# EAGLE schematic PKG900000001531 (EAGLE 7.7.0), part 2 of 2
## Sheet 25 of 32
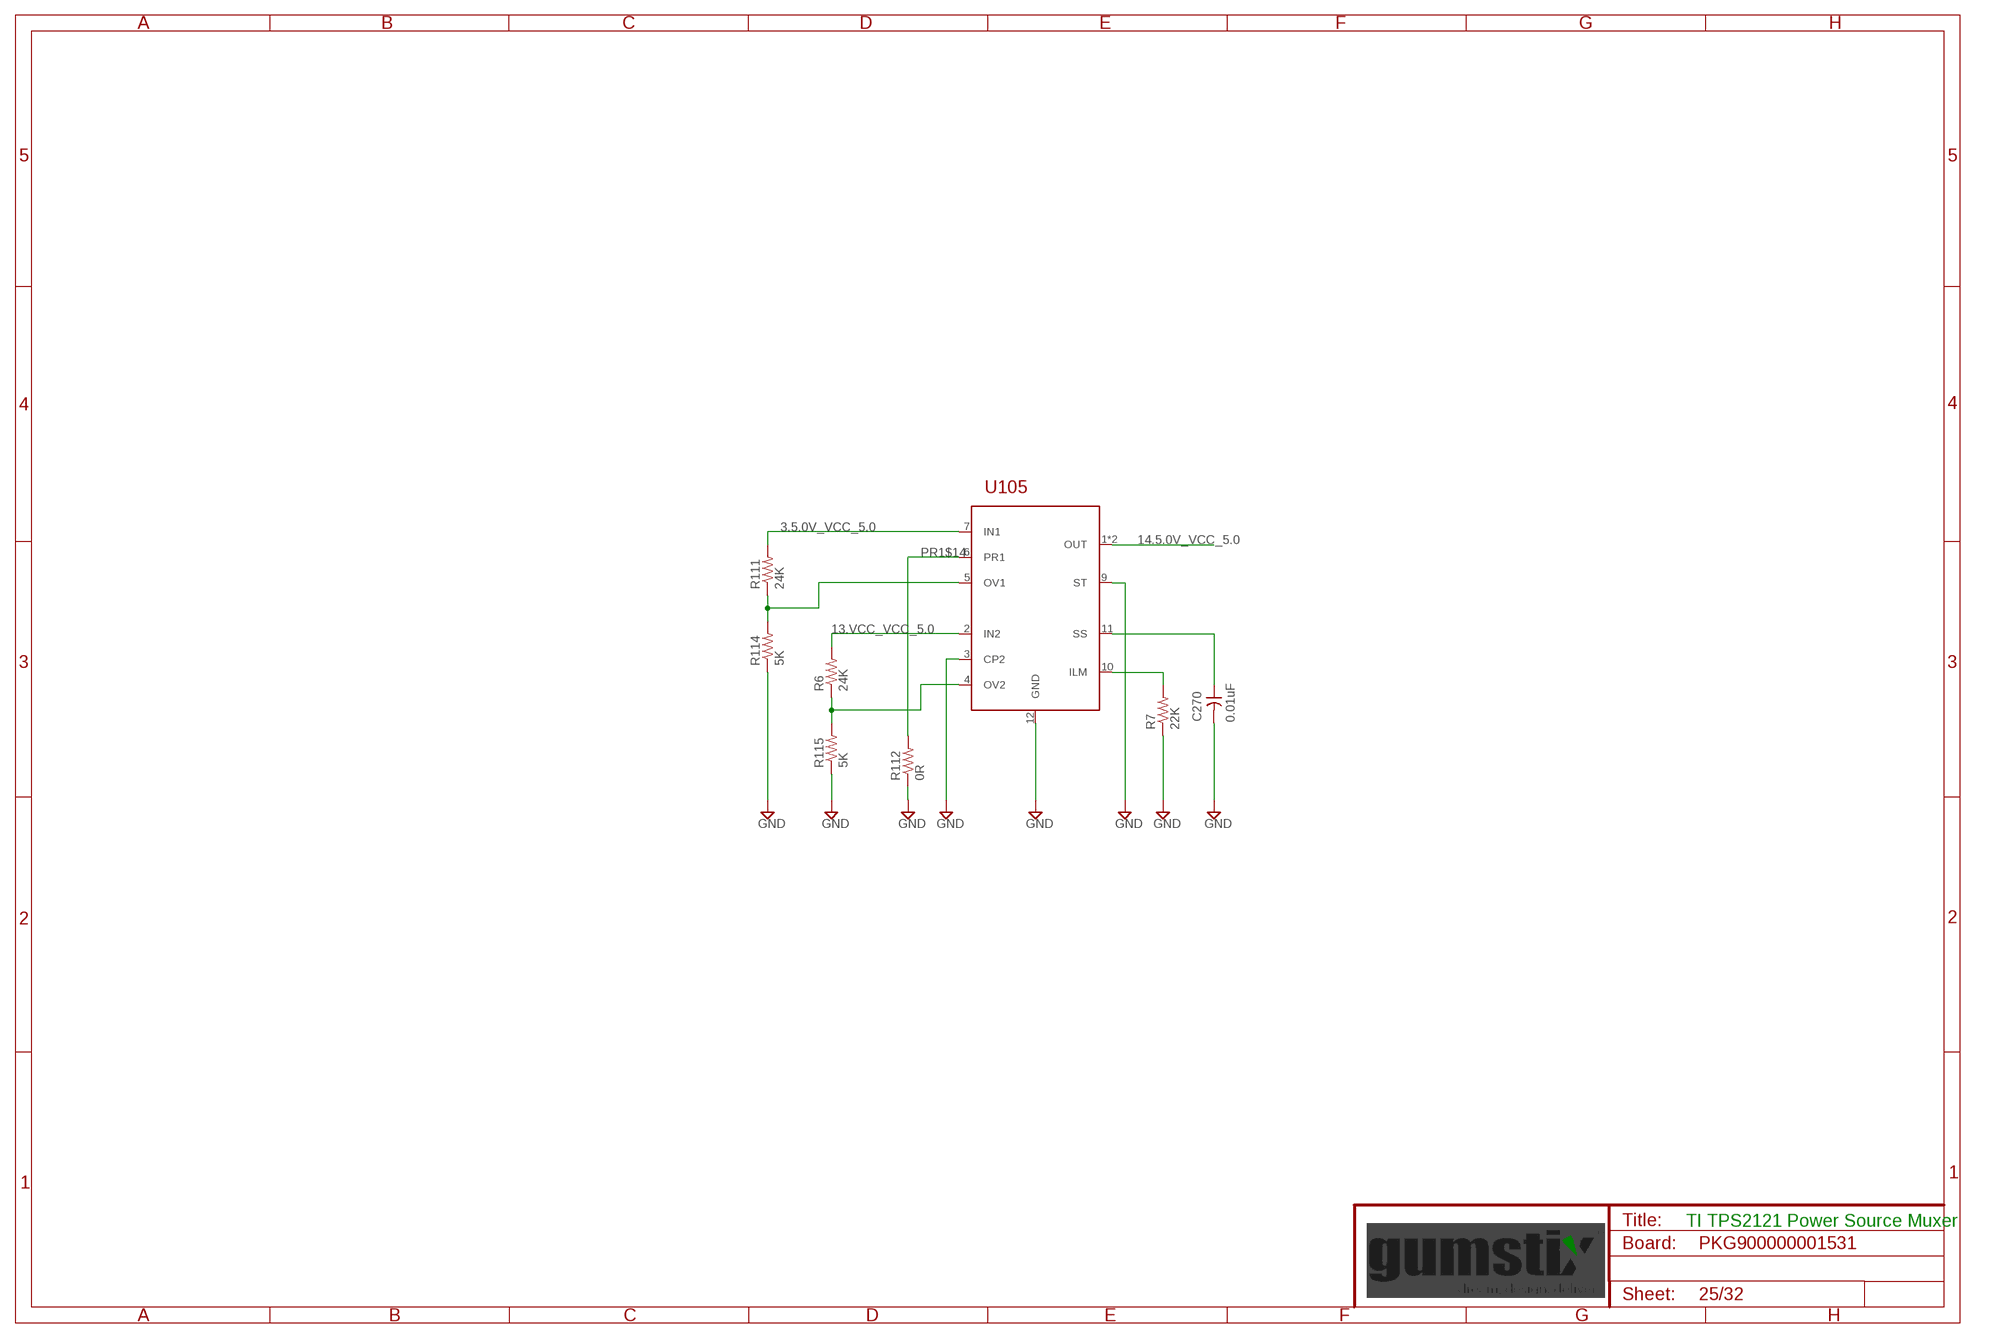
[diagram p24: schematic, sheet 25]

### Parts
C270  0.01uF  C0201  [0201]
R6  24K  R0201  [0201]
R7  22K  R0201  [0201]
R111  24K  R0201  [0201]
R112  0R  R0201  [0201]
R114  5K  R0201  [0201]
R115  5K  R0201  [0201]
U105  TPS2121  [VQFN12-HR]

### Nets
3.5.0V_VCC_5.0 [supply]: R111.2 U105.7(IN1) ; also sheet 13
13.VCC_VCC_5.0: R6.2 U105.2(IN2) ; also sheet 24
14.5.0V_VCC_5.0 [supply]: U105.1(OUT) U105.8(OUT) ; also sheet 3,12,17
GND [supply]: C270.2 R7.1 R112.1 R114.1 R115.1 U105.3(CP2) U105.9(ST) U105.12(GND) ; also sheet 2,3,4,5,6,7,8,9,10,12,13,14,15,16,17,18,19,20,21,22,23,24,26,27,28,29,30,31,32
ILUM$14: R7.2 U105.10(ILM)
OV1$14: R111.1 R114.2 U105.5(OV1)
OV2$14: R6.1 R115.2 U105.4(OV2)
PR1$14 [supply]: R112.2 U105.6(PR1)
SS$14 [supply]: C270.1 U105.11(SS)

### Notes on the sheet
- TI TPS2121 Power Source Muxer

## Sheet 26 of 32
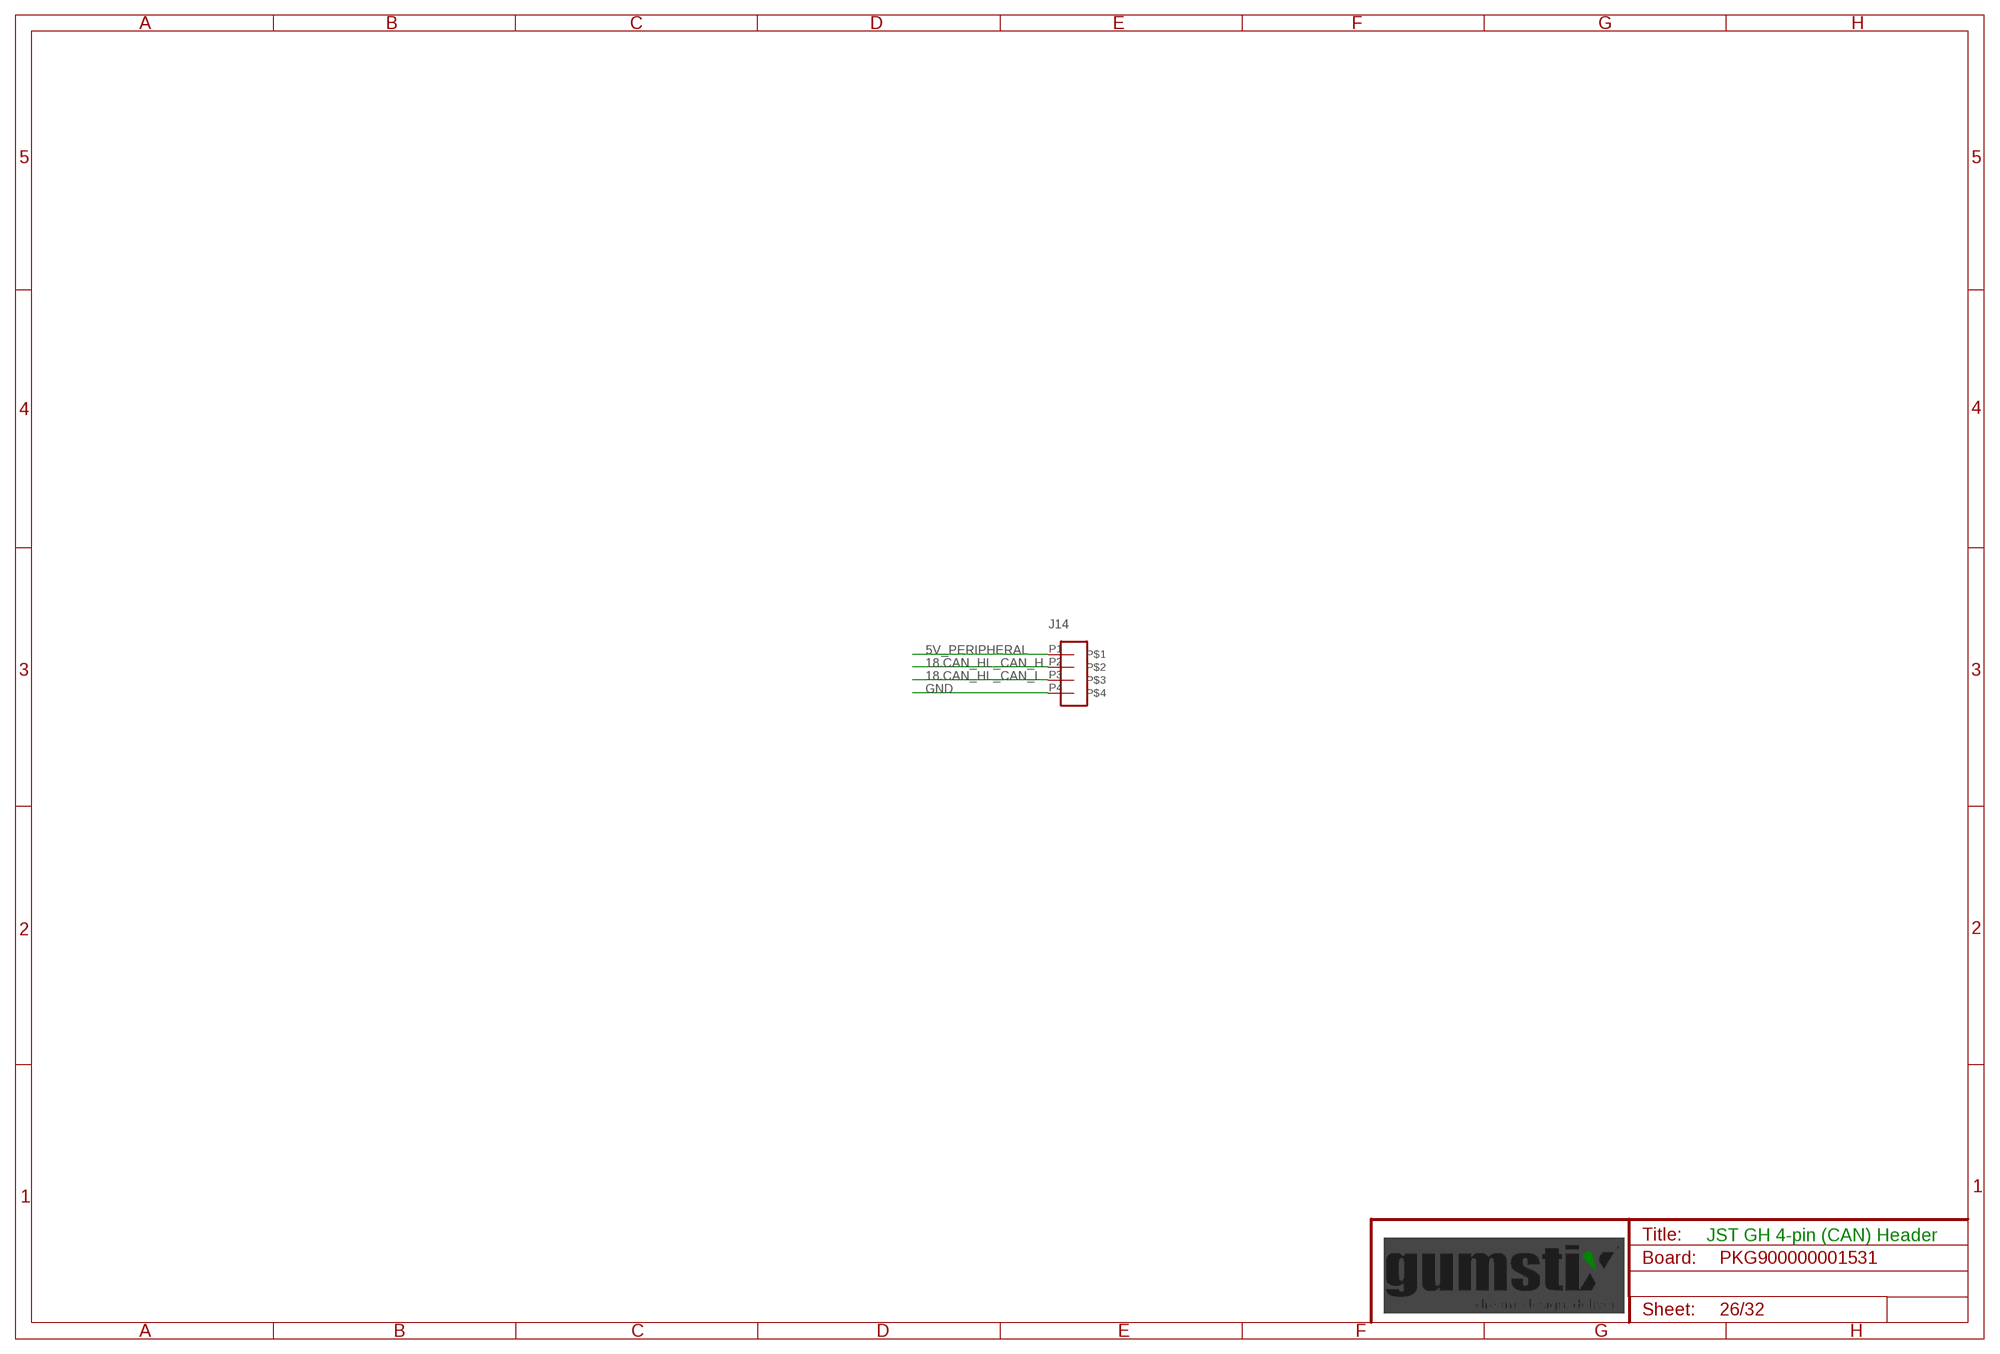
[diagram p25: schematic, sheet 26]

### Parts
J14  JST-GH-4H  [JST-GH-4H]

### Nets
5V_PERIPHERAL [supply]: J14.P1 ; also sheet 3,23,27,29
18.CAN_HL_CAN_H: J14.P2 ; also sheet 29
18.CAN_HL_CAN_L: J14.P3 ; also sheet 29
GND [supply]: J14.P4 ; also sheet 2,3,4,5,6,7,8,9,10,12,13,14,15,16,17,18,19,20,21,22,23,24,25,27,28,29,30,31,32

### Notes on the sheet
- JST GH 4-pin (CAN) Header

## Sheet 27 of 32
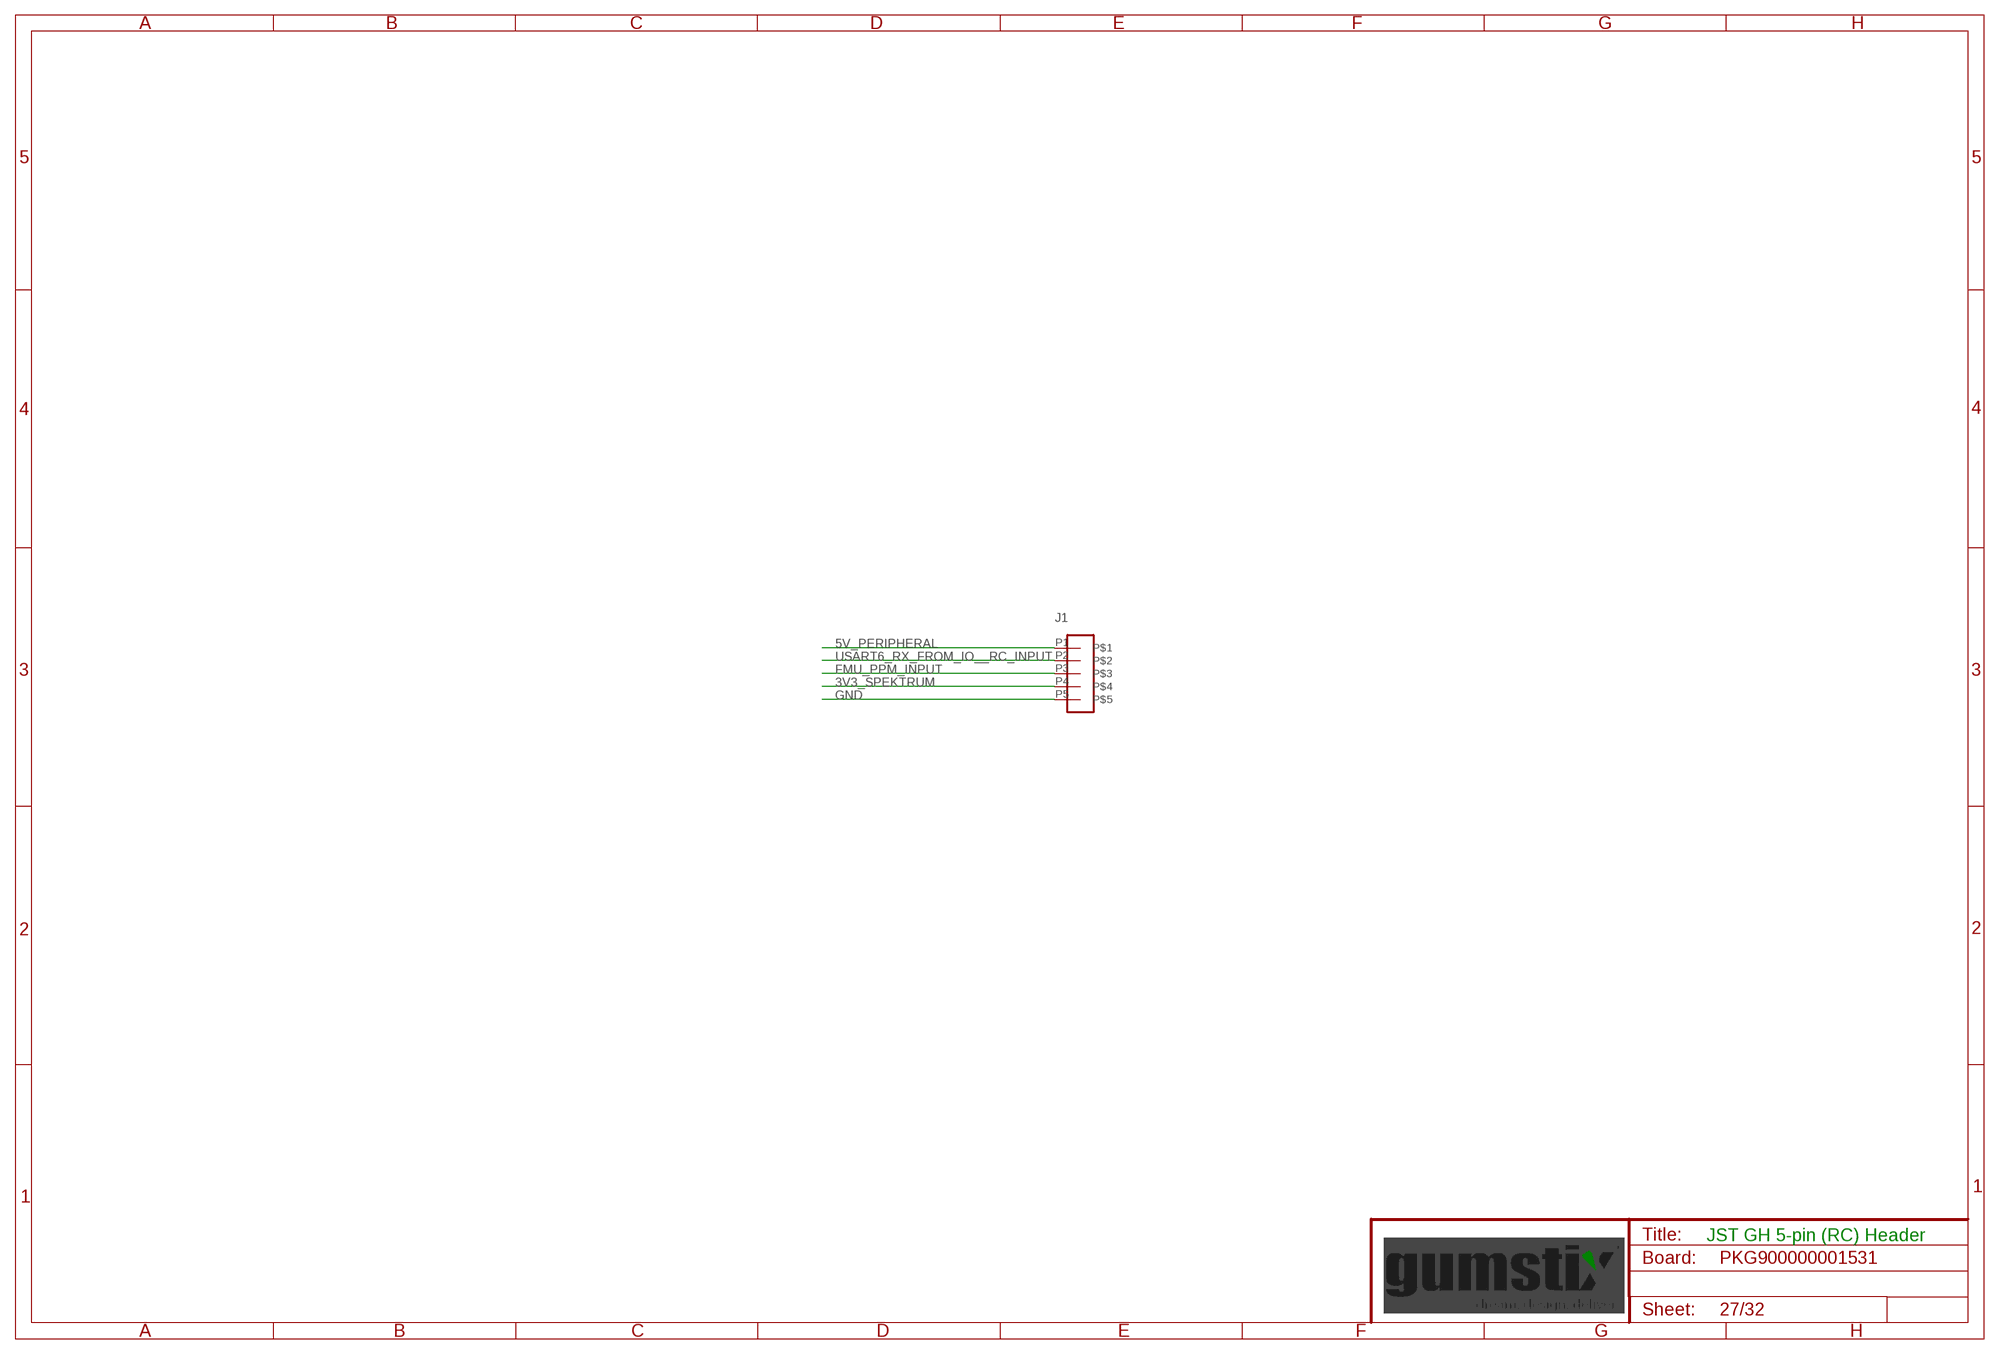
[diagram p26: schematic, sheet 27]

### Parts
J1  JST-GH-5H  [JST-GH-5H]

### Nets
3V3_SPEKTRUM [supply]: J1.P4 ; also sheet 3
5V_PERIPHERAL [supply]: J1.P1 ; also sheet 3,23,26,29
FMU_PPM_INPUT: J1.P3 ; also sheet 2
GND [supply]: J1.P5 ; also sheet 2,3,4,5,6,7,8,9,10,12,13,14,15,16,17,18,19,20,21,22,23,24,25,26,28,29,30,31,32
USART6_RX_FROM_IO__RC_INPUT: J1.P2 ; also sheet 2

### Notes on the sheet
- JST GH 5-pin (RC) Header

## Sheet 28 of 32
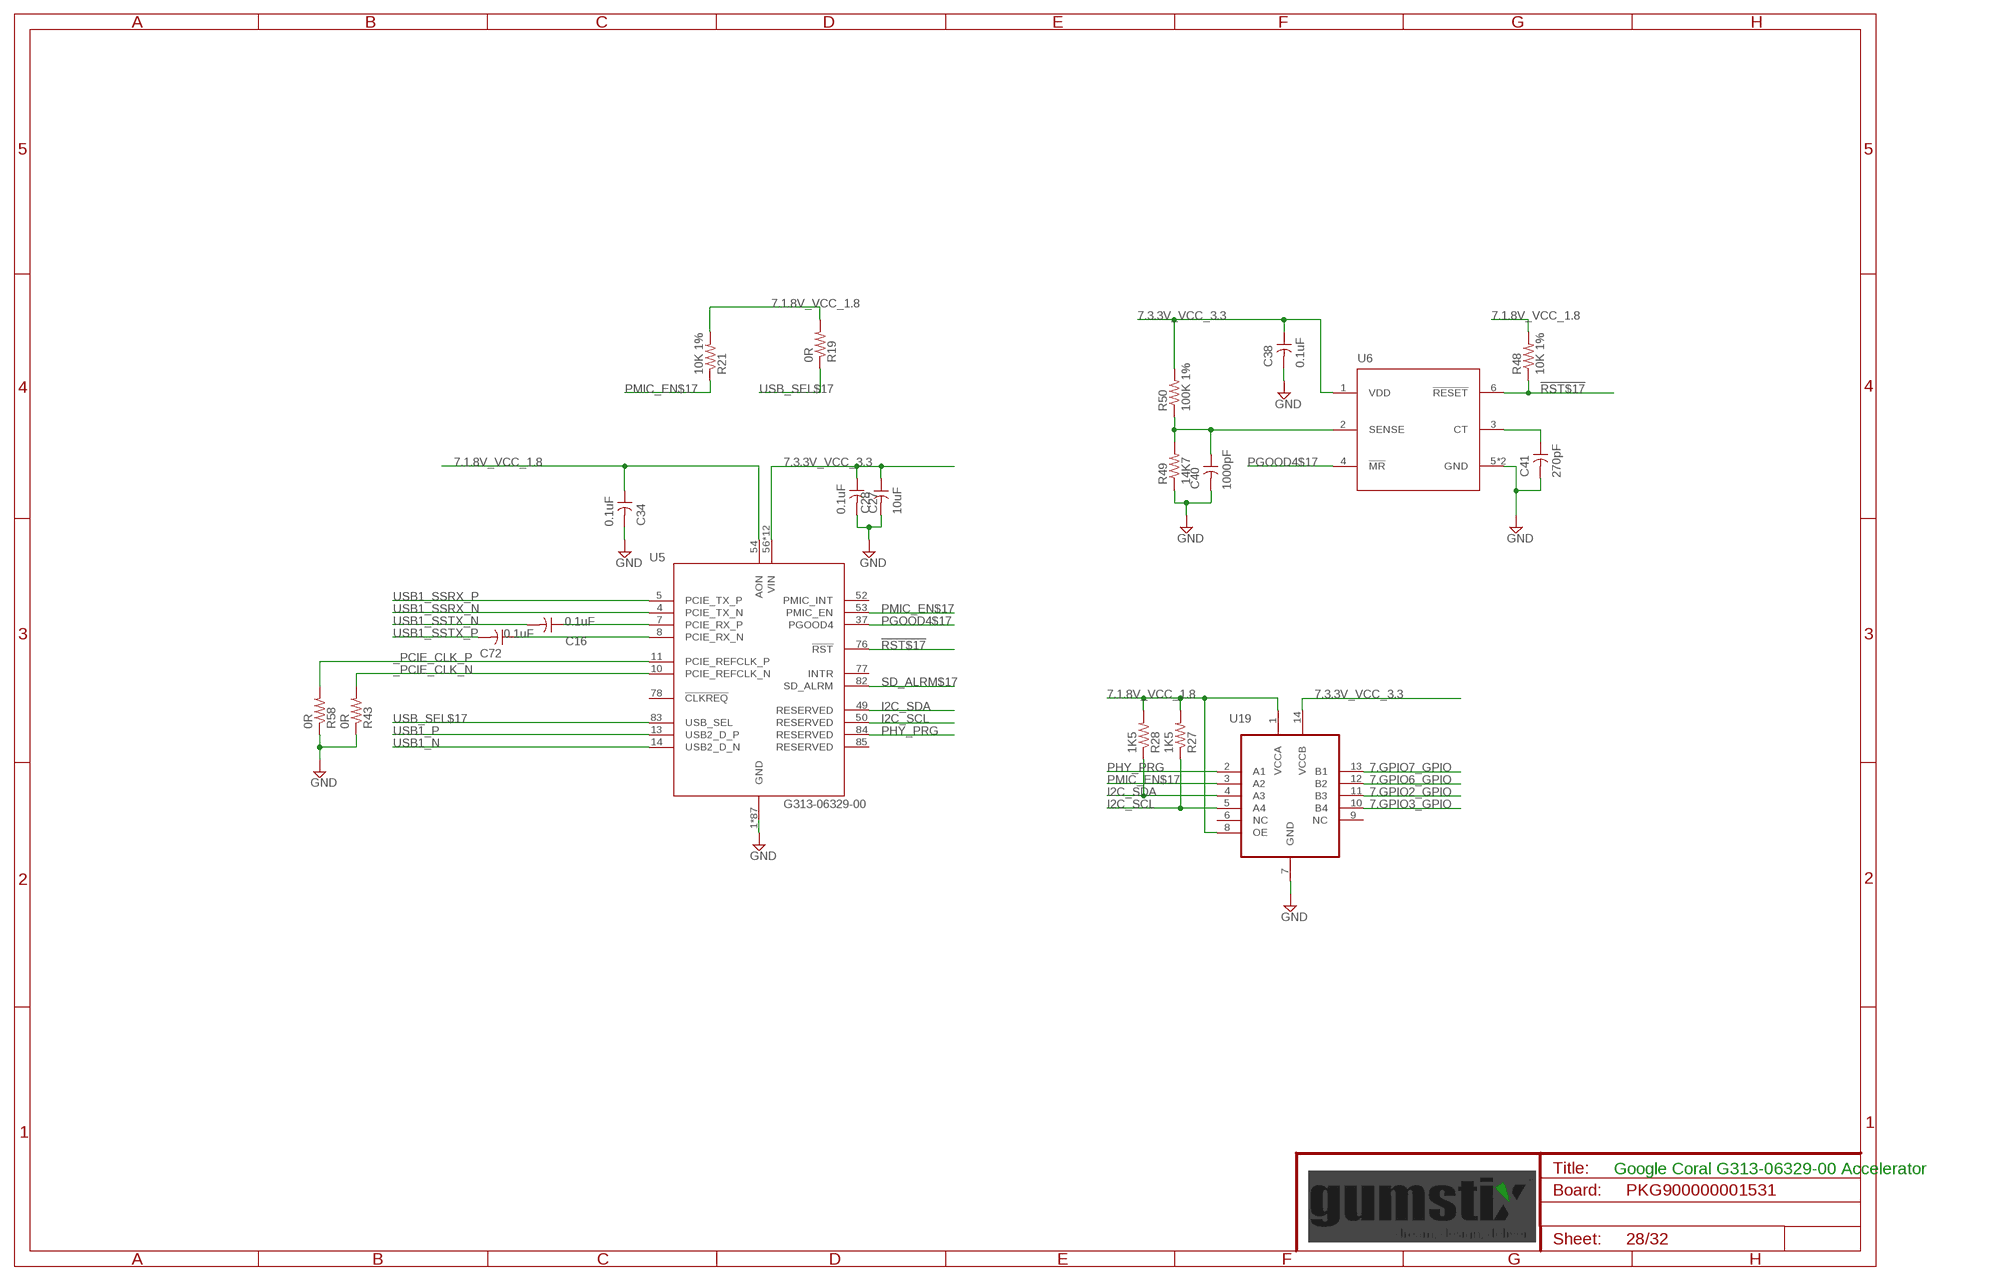
[diagram p27: schematic, sheet 28]

### Parts
C16  0.1uF  C0201  [0201]
C27  0.1uF  C0201  [0201]
C28  10uF  C0603  [0603]
C34  0.1uF  C0201  [0201]
C38  0.1uF  C0201  [0201]
C40  1000pF  C0201  [0201]
C41  270pF  C0201  [0201]
C72  0.1uF  C0201  [0201]
R19  0R  R0201  [0201]
R21  10K 1%  R0201  [0201]
R27  1K5  R0201  [0201]
R28  1K5  R0201  [0201]
R43  0R  R0201  [0201]
R48  10K 1%  R0201  [0201]
R49  14K7  R0201  [0201]
R50  100K 1%  R0201  [0201]
R58  0R  R0201  [0201]
U5  G313-06329-00  [G313-06329-00]
U6  NCP308  [WDFN6]
U19  TXS0104E  [S-PVQFN-N14]

### Nets
7.1.8V_VCC_1.8: C34.1 R19.2 R21.2 R27.2 R28.2 R48.2 U5.54(AON) U19.1(VCCA) U19.8(OE) ; also sheet 17
7.3.3V_VCC_3.3 [supply]: C27.1 C28.1 C38.1 R50.2 U5.56(VIN) U5.57(VIN) U5.58(VIN) U5.59(VIN) U5.60(VIN) U5.61(VIN) U5.62(VIN) U5.63(VIN) U5.64(VIN) U5.65(VIN) U5.66(VIN) U5.67(VIN) U6.1(VDD) U19.14(VCCB) ; also sheet 17,27
7.GPIO2_GPIO: U19.11(B3) ; also sheet 17
7.GPIO3_GPIO: U19.10(B4) ; also sheet 17
7.GPIO6_GPIO: U19.12(B2) ; also sheet 17
7.GPIO7_GPIO: U19.13(B1) ; also sheet 17
!RST$17: R48.1 U5.76(!RST) U6.6(!RESET)
_PCIE_CLK_N [USB]: R43.2 U5.10(PCIE_REFCLK_N)
_PCIE_CLK_P [USB]: R58.2 U5.11(PCIE_REFCLK_P)
CT1$17 [supply]: C41.1 U6.3(CT)
GND [supply]: C27.2 C28.2 C34.2 C38.2 C40.2 C41.2 R43.1 R49.1 R58.1 U5.1(GND) U5.2(GND) U5.3(GND) U5.6(GND) U5.9(GND) U5.12(GND) U5.15(GND) U5.16(GND) U5.17(GND) U5.18(GND) U5.19(GND) U5.20(GND) U5.21(GND) U5.22(GND) U5.23(GND) U5.24(GND) U5.25(GND) U5.26(GND) U5.27(GND) U5.28(GND) U5.29(GND) U5.30(GND) U5.31(GND) U5.32(GND) U5.33(GND) U5.34(GND) U5.35(GND) U5.36(GND) U5.38(GND) U5.39(GND) U5.40(GND) U5.41(GND) U5.42(GND) U5.43(GND) U5.44(GND) U5.45(GND) U5.46(GND) U5.47(GND) U5.48(GND) U5.51(GND) U5.55(GND) U5.68(GND) U5.69(GND) U5.70(GND) U5.71(GND) U5.72(GND) U5.73(GND) U5.74(GND) U5.75(GND) U5.79(GND) U5.80(GND) U5.81(GND) U5.86(GND) U5.87(GND) U5.88(GND) U5.89(GND) U5.90(GND) U5.91(GND) U5.92(GND) U5.93(GND) U5.94(GND) U5.95(GND) U5.96(GND) U5.97(GND) U5.98(GND) U5.99(GND) U5.100(GND) U5.101(GND) U5.102(GND) U5.103(GND) U5.104(GND) U5.105(GND) U5.106(GND) U5.107(GND) U5.108(GND) U5.109(GND) U5.110(GND) U5.111(GND) U5.112(GND) U5.113(GND) U5.114(GND) U5.115(GND) U5.116(GND) U5.117(GND) U5.118(GND) U5.119(GND) U5.120(GND) U6.5(GND) U6.EPAD(GND) U19.7(GND) ; also sheet 2,3,4,5,6,7,8,9,10,12,13,14,15,16,17,18,19,20,21,22,23,24,25,26,27,29,30,31,32
I2C_SCL: R27.1 U5.50(RESERVED) U19.5(A4)
I2C_SDA: R28.1 U5.49(RESERVED) U19.4(A3)
PGOOD4$17: U5.37(PGOOD4) U6.4(!MR)
PHY_PRG: U5.84(RESERVED) U19.2(A1)
PMIC_EN$17: R21.1 U5.53(PMIC_EN) U19.3(A2)
SD_ALRM$17: U5.82(SD_ALRM)
SENSE$17: C40.1 R49.2 R50.1 U6.2(SENSE)
USB1_N [USB]: U5.14(USB2_D_N) ; also sheet 32
USB1_P [USB]: U5.13(USB2_D_P) ; also sheet 32
USB1_SSRX_N [USB]: U5.4(PCIE_TX_N) ; also sheet 32
USB1_SSRX_P [USB]: U5.5(PCIE_TX_P) ; also sheet 32
USB1_SSTX__N [USB]: C16.1 U5.7(PCIE_RX_P)
USB1_SSTX__P [USB]: C72.1 U5.8(PCIE_RX_N)
USB1_SSTX_N [USB]: C16.2 ; also sheet 32
USB1_SSTX_P [USB]: C72.2 ; also sheet 32
USB_SEL$17: R19.1 U5.83(USB_SEL)
Unconnected: U5.52(PMIC_INT) U5.77(INTR) U5.78(!CLKREQ) U5.85(RESERVED) U19.6(NC) U19.9(NC)

### Notes on the sheet
- Google Coral G313-06329-00 Accelerator

## Sheet 29 of 32
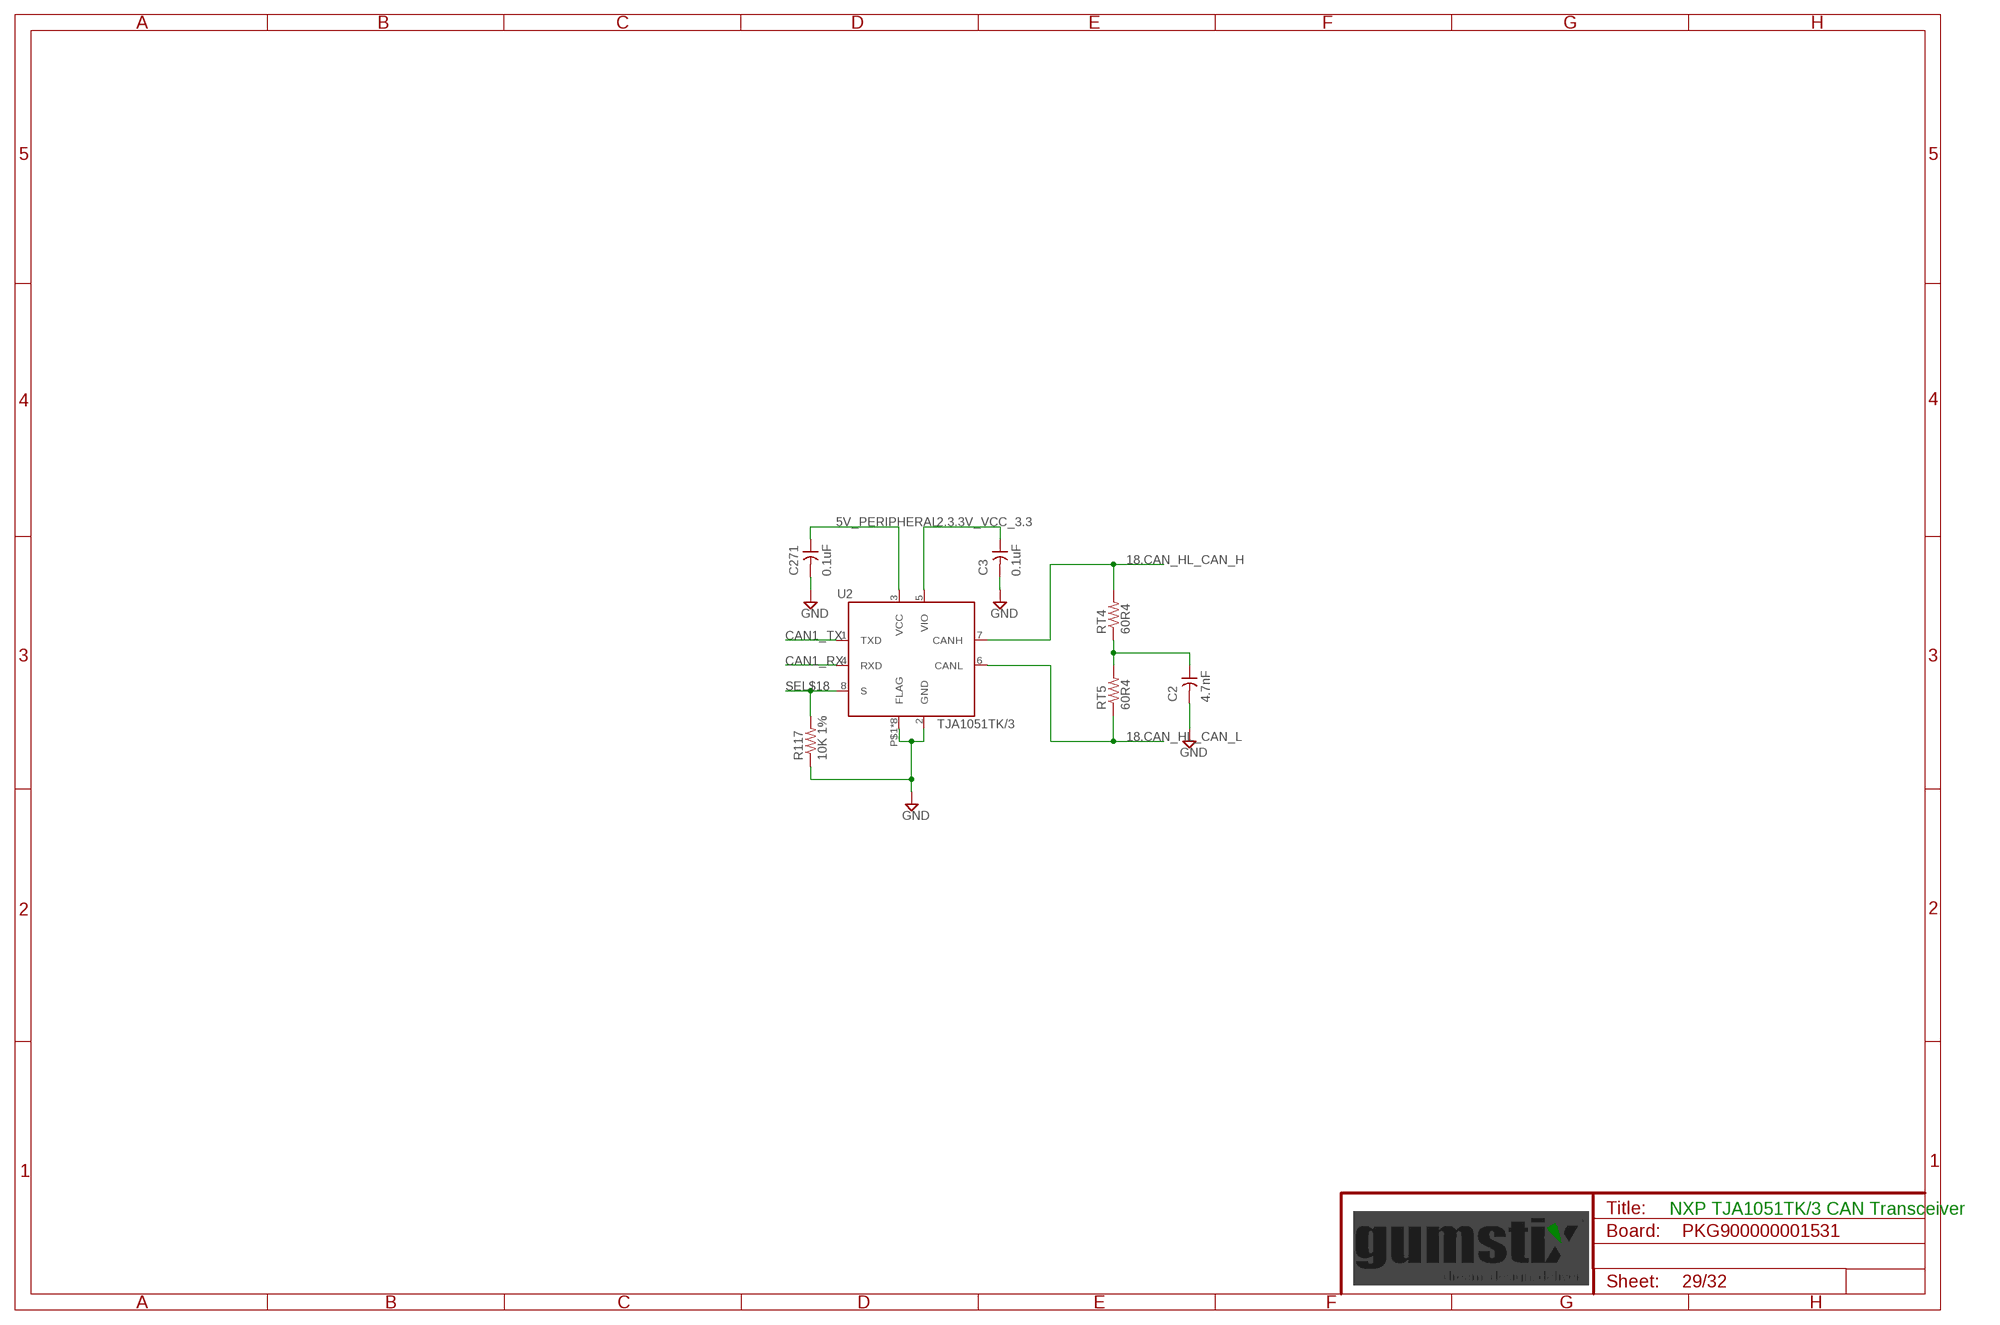
[diagram p28: schematic, sheet 29]

### Parts
C2  4.7nF  C0201  [0201]
C3  0.1uF  C0201  [0201]
C271  0.1uF  C0201  [0201]
R117  10K 1%  R0201  [0201]
RT4  60R4  R0805  [0805]
RT5  60R4  R0805  [0805]
U2  TJA1051TK/3  [HVSON8]

### Nets
2.3.3V_VCC_3.3 [supply]: C3.1 U2.5(VIO) ; also sheet 2,3,4,5,11,12,14,15,19,20,21,22,30,32
5V_PERIPHERAL [supply]: C271.1 U2.3(VCC) ; also sheet 3,23,26,27
18.CAN_HL_CAN_H: RT4.2 U2.7(CANH) ; also sheet 26
18.CAN_HL_CAN_L: RT5.1 U2.6(CANL) ; also sheet 26
CAN1_RX: U2.4(RXD) ; also sheet 2
CAN1_TX: U2.1(TXD) ; also sheet 2
CAP$18: C2.1 RT4.1 RT5.2
GND [supply]: C2.2 C3.2 C271.2 R117.1 U2.2(GND) U2.P$1(FLAG) U2.P$2(FLAG) U2.P$3(FLAG) U2.P$4(FLAG) U2.P$5(FLAG) U2.P$6(FLAG) U2.P$8(FLAG) U2.P$9(FLAG) ; also sheet 2,3,4,5,6,7,8,9,10,12,13,14,15,16,17,18,19,20,21,22,23,24,25,26,27,28,30,31,32
SEL$18: R117.2 U2.8(S)

### Notes on the sheet
- NXP TJA1051TK/3 CAN Transceiver

## Sheet 30 of 32
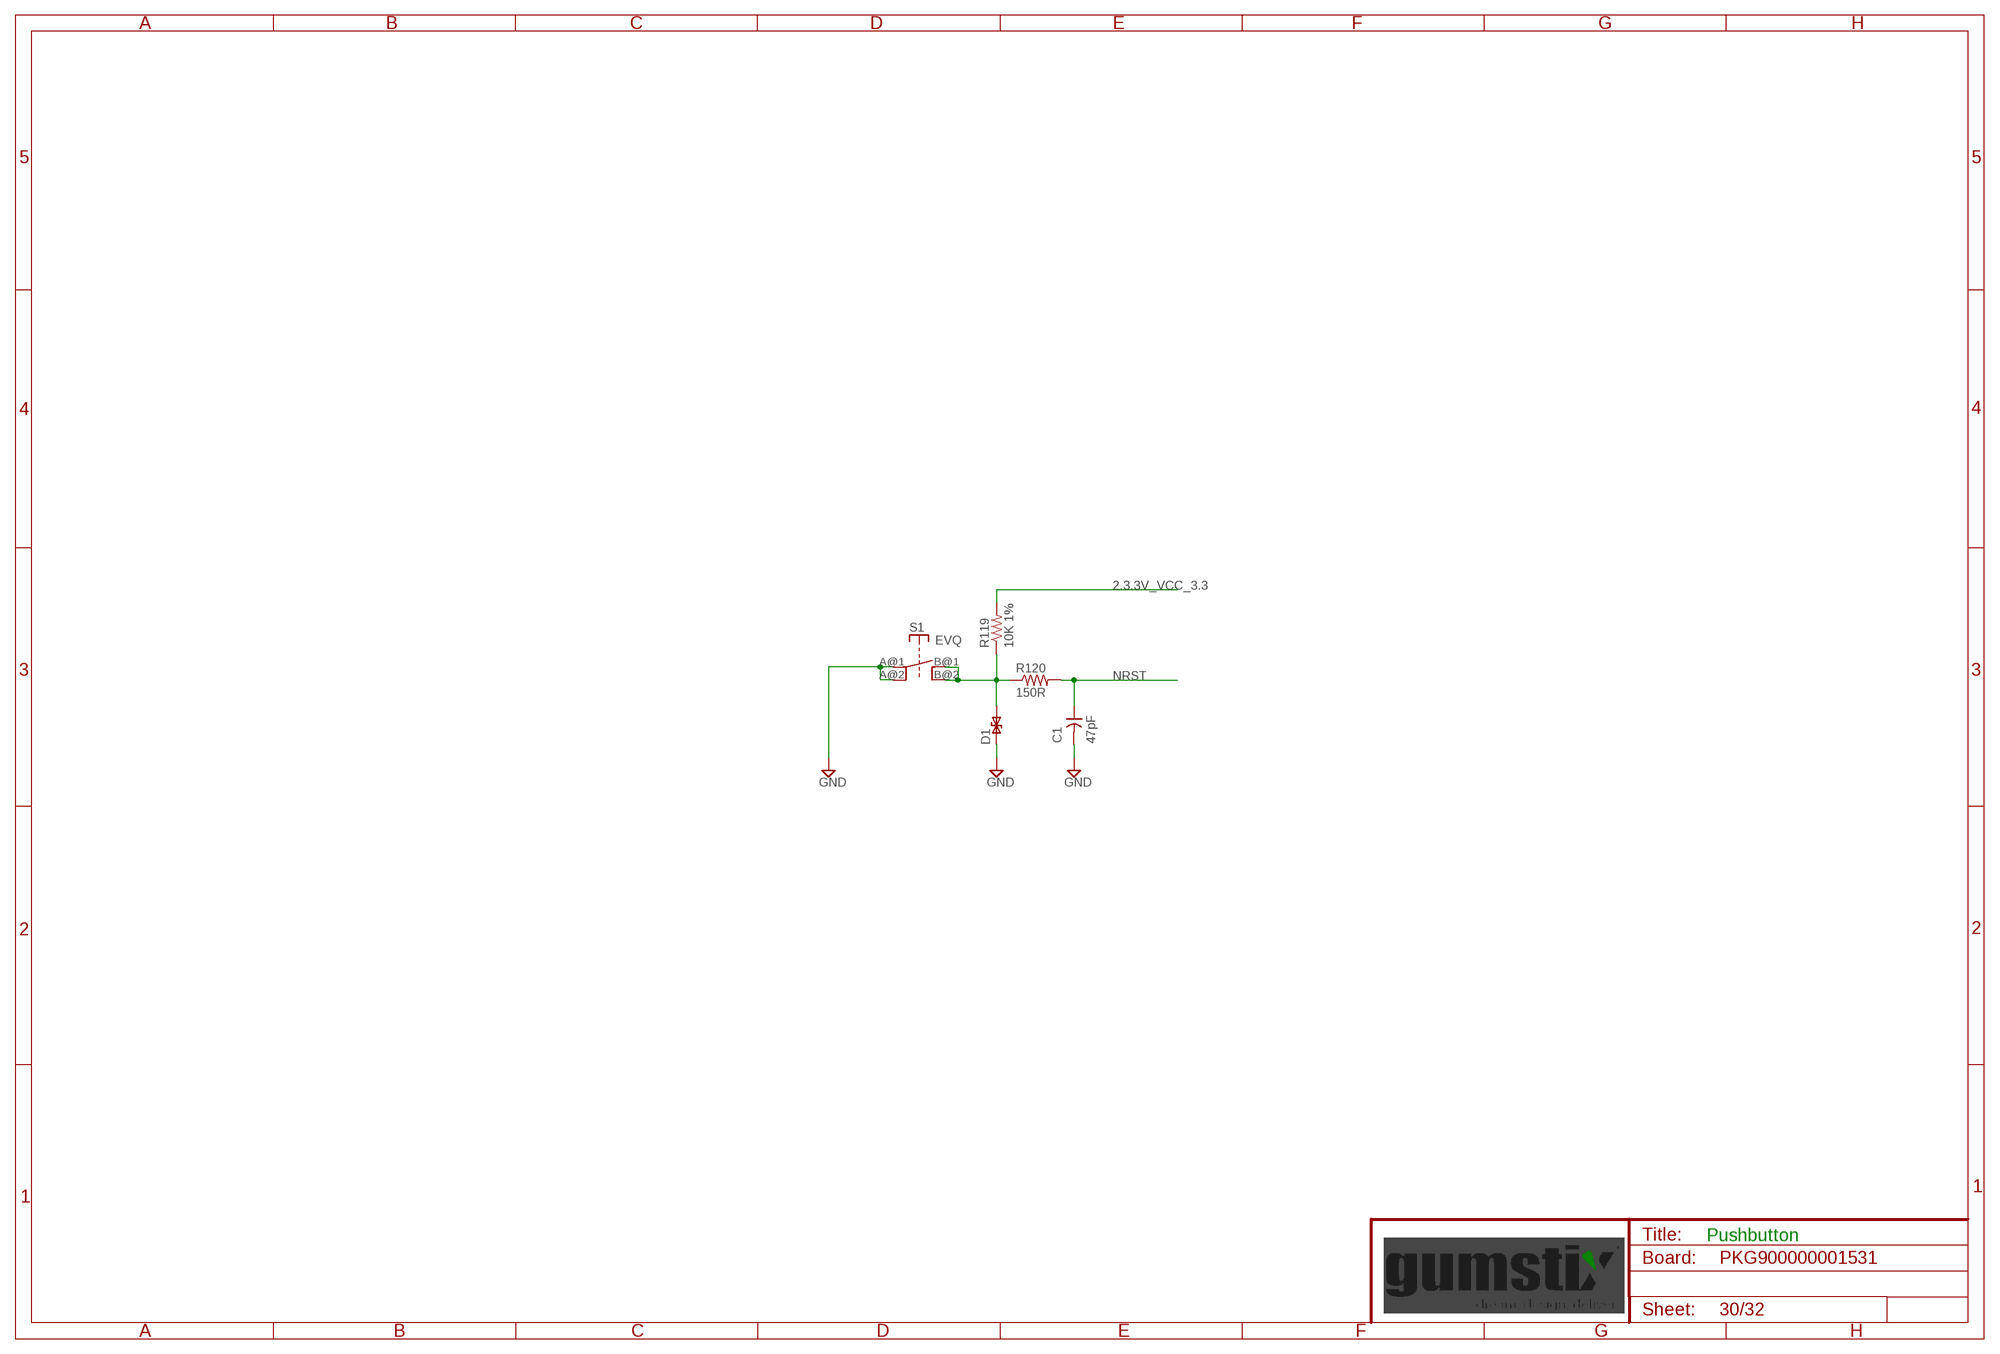
[diagram p29: schematic, sheet 30]

### Parts
C1  47pF  C0201  [0201]
D1  B72590D50A060  ESD-DIODE  [D0402]
R119  10K 1%  R0201  [0201]
R120  150R  R0201  [0201]
S1  EVQ  [EVQ]

### Nets
2.3.3V_VCC_3.3 [supply]: R119.2 ; also sheet 2,3,4,5,11,12,14,15,19,20,21,22,29,32
BTN_A$22: D1.P2 R119.1 R120.1 S1.B@1(B) S1.B@2(B')
GND [supply]: C1.2 D1.P1 S1.A@1(A) S1.A@2(A') ; also sheet 2,3,4,5,6,7,8,9,10,12,13,14,15,16,17,18,19,20,21,22,23,24,25,26,27,28,29,31,32
NRST: C1.1 R120.2 ; also sheet 2,3

### Notes on the sheet
- Pushbutton

## Sheet 31 of 32
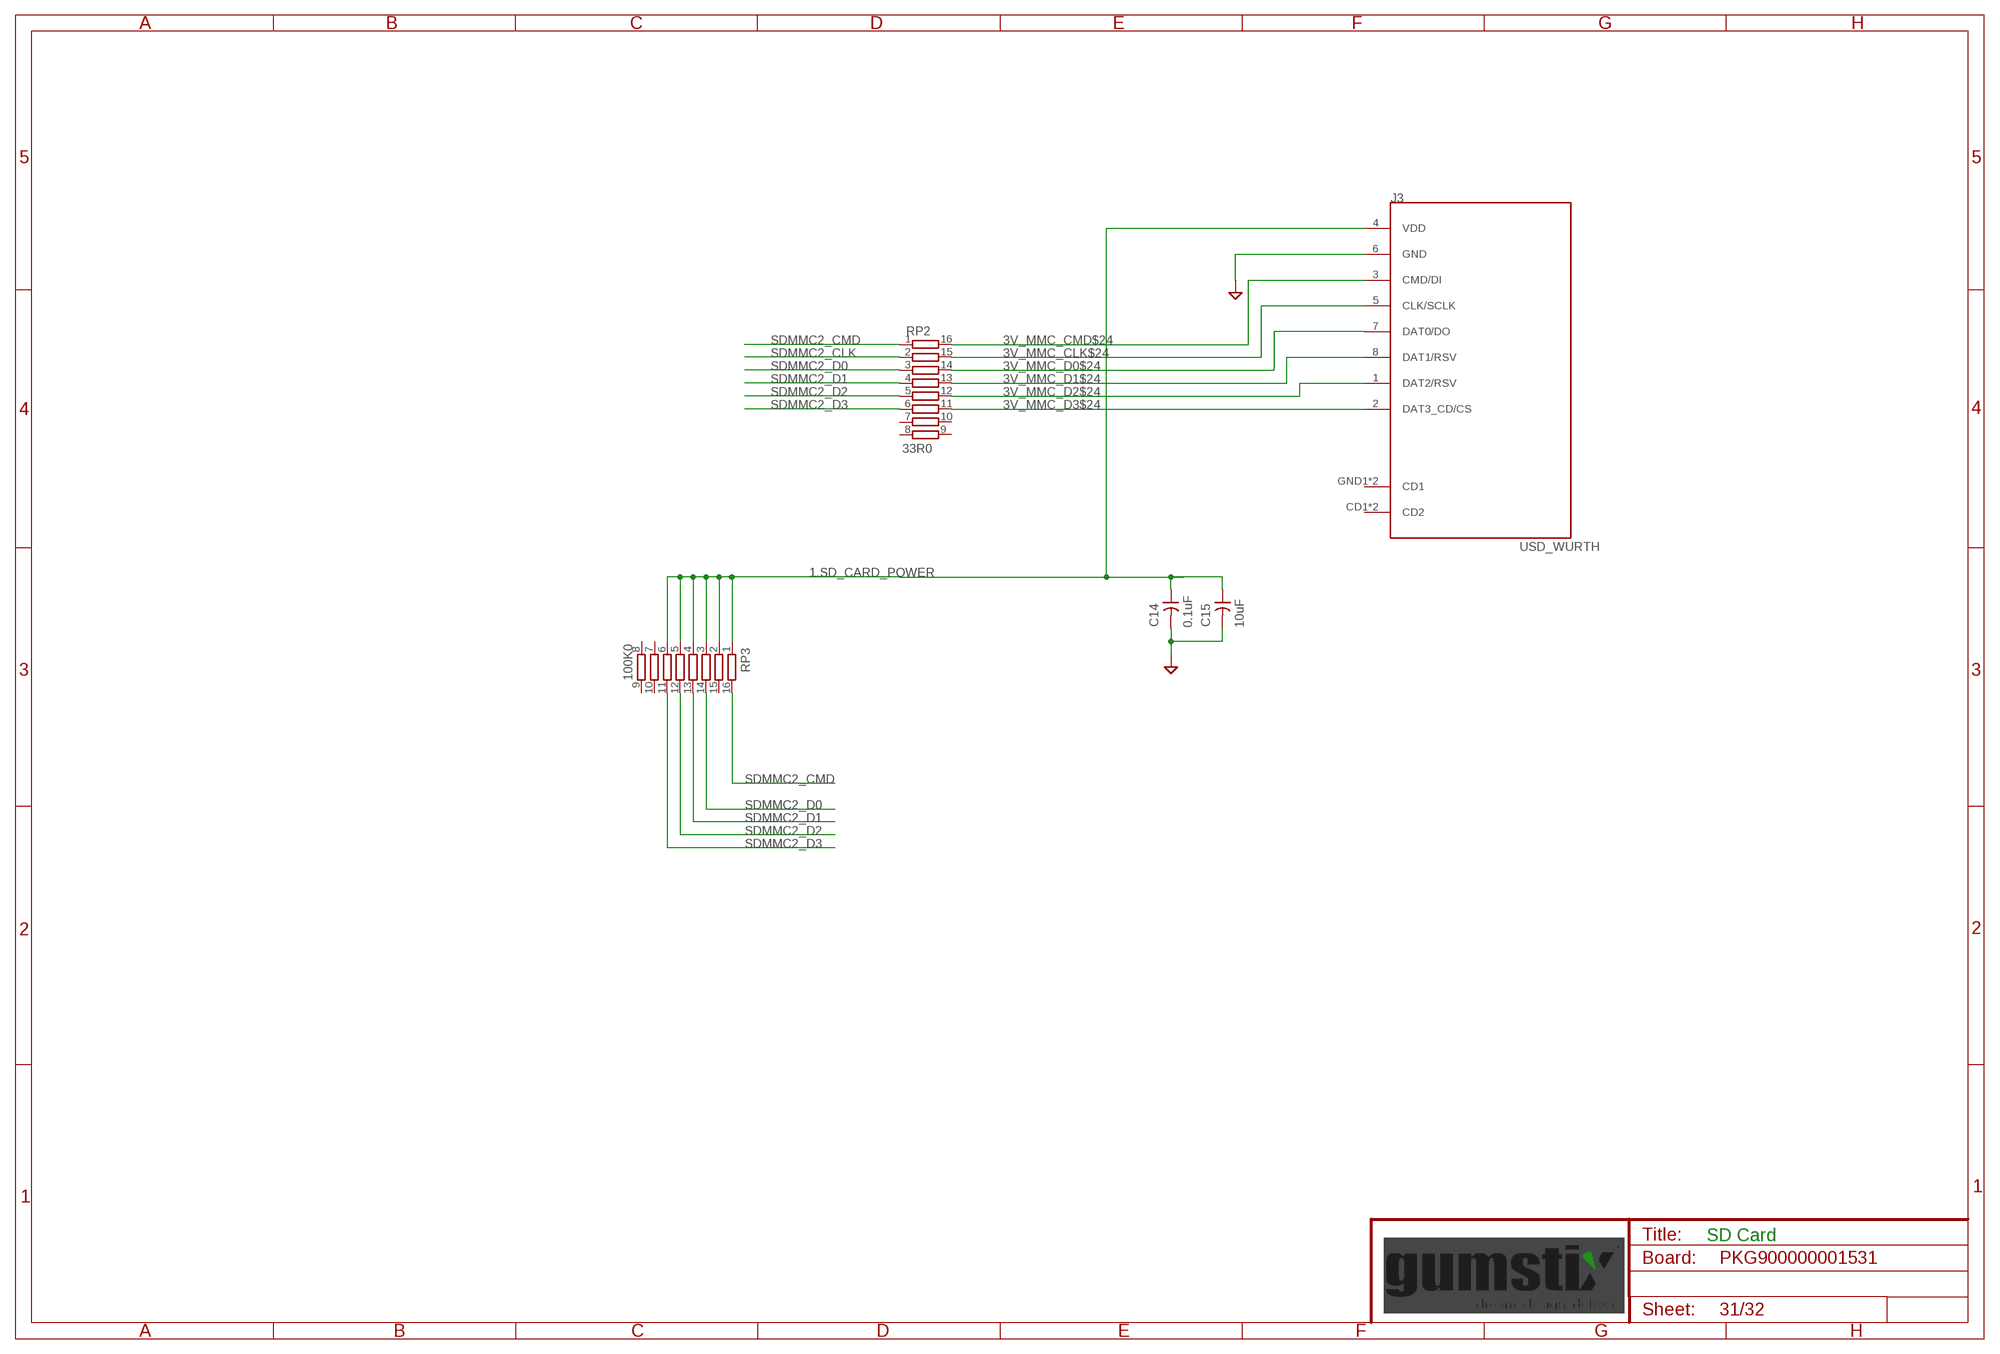
[diagram p30: schematic, sheet 31]

### Parts
C14  0.1uF  C0201  [0201]
C15  10uF  C0603  [0603]
J3  USD_WURTH  [USD]
RP2  33R0  RP741X163  [741X16]
RP3  100K0  RP741X163  [741X16]

### Nets
1.SD_CARD_POWER: C14.1 C15.1 J3.4(VDD) RP3.1 RP3.2 RP3.3 RP3.4 RP3.5 RP3.6 ; also sheet 3
3V_MMC_CLK$24: J3.5(CLK/SCLK) RP2.15
3V_MMC_CMD$24: J3.3(CMD/DI) RP2.16
3V_MMC_D0$24: J3.7(DAT0/DO) RP2.14
3V_MMC_D1$24: J3.8(DAT1/RSV) RP2.13
3V_MMC_D2$24: J3.1(DAT2/RSV) RP2.12
3V_MMC_D3$24: J3.2(DAT3_CD/CS) RP2.11
GND [supply]: C14.2 C15.2 J3.6(GND) ; also sheet 2,3,4,5,6,7,8,9,10,12,13,14,15,16,17,18,19,20,21,22,23,24,25,26,27,28,29,30,32
SDMMC2_CLK: RP2.2 ; also sheet 2
SDMMC2_CMD: RP2.1 RP3.16 ; also sheet 2
SDMMC2_D0: RP2.3 RP3.14 ; also sheet 2
SDMMC2_D1: RP2.4 RP3.13 ; also sheet 2
SDMMC2_D2: RP2.5 RP3.12 ; also sheet 2
SDMMC2_D3: RP2.6 RP3.11 ; also sheet 2
Unconnected: J3.CD1(CD2) J3.CD2 J3.GND1(CD1) J3.GND3(CD1) RP2.7 RP2.8 RP2.9 RP2.10 RP3.7 RP3.8 RP3.9 RP3.10 RP3.15

### Notes on the sheet
- SD Card

## Sheet 32 of 32
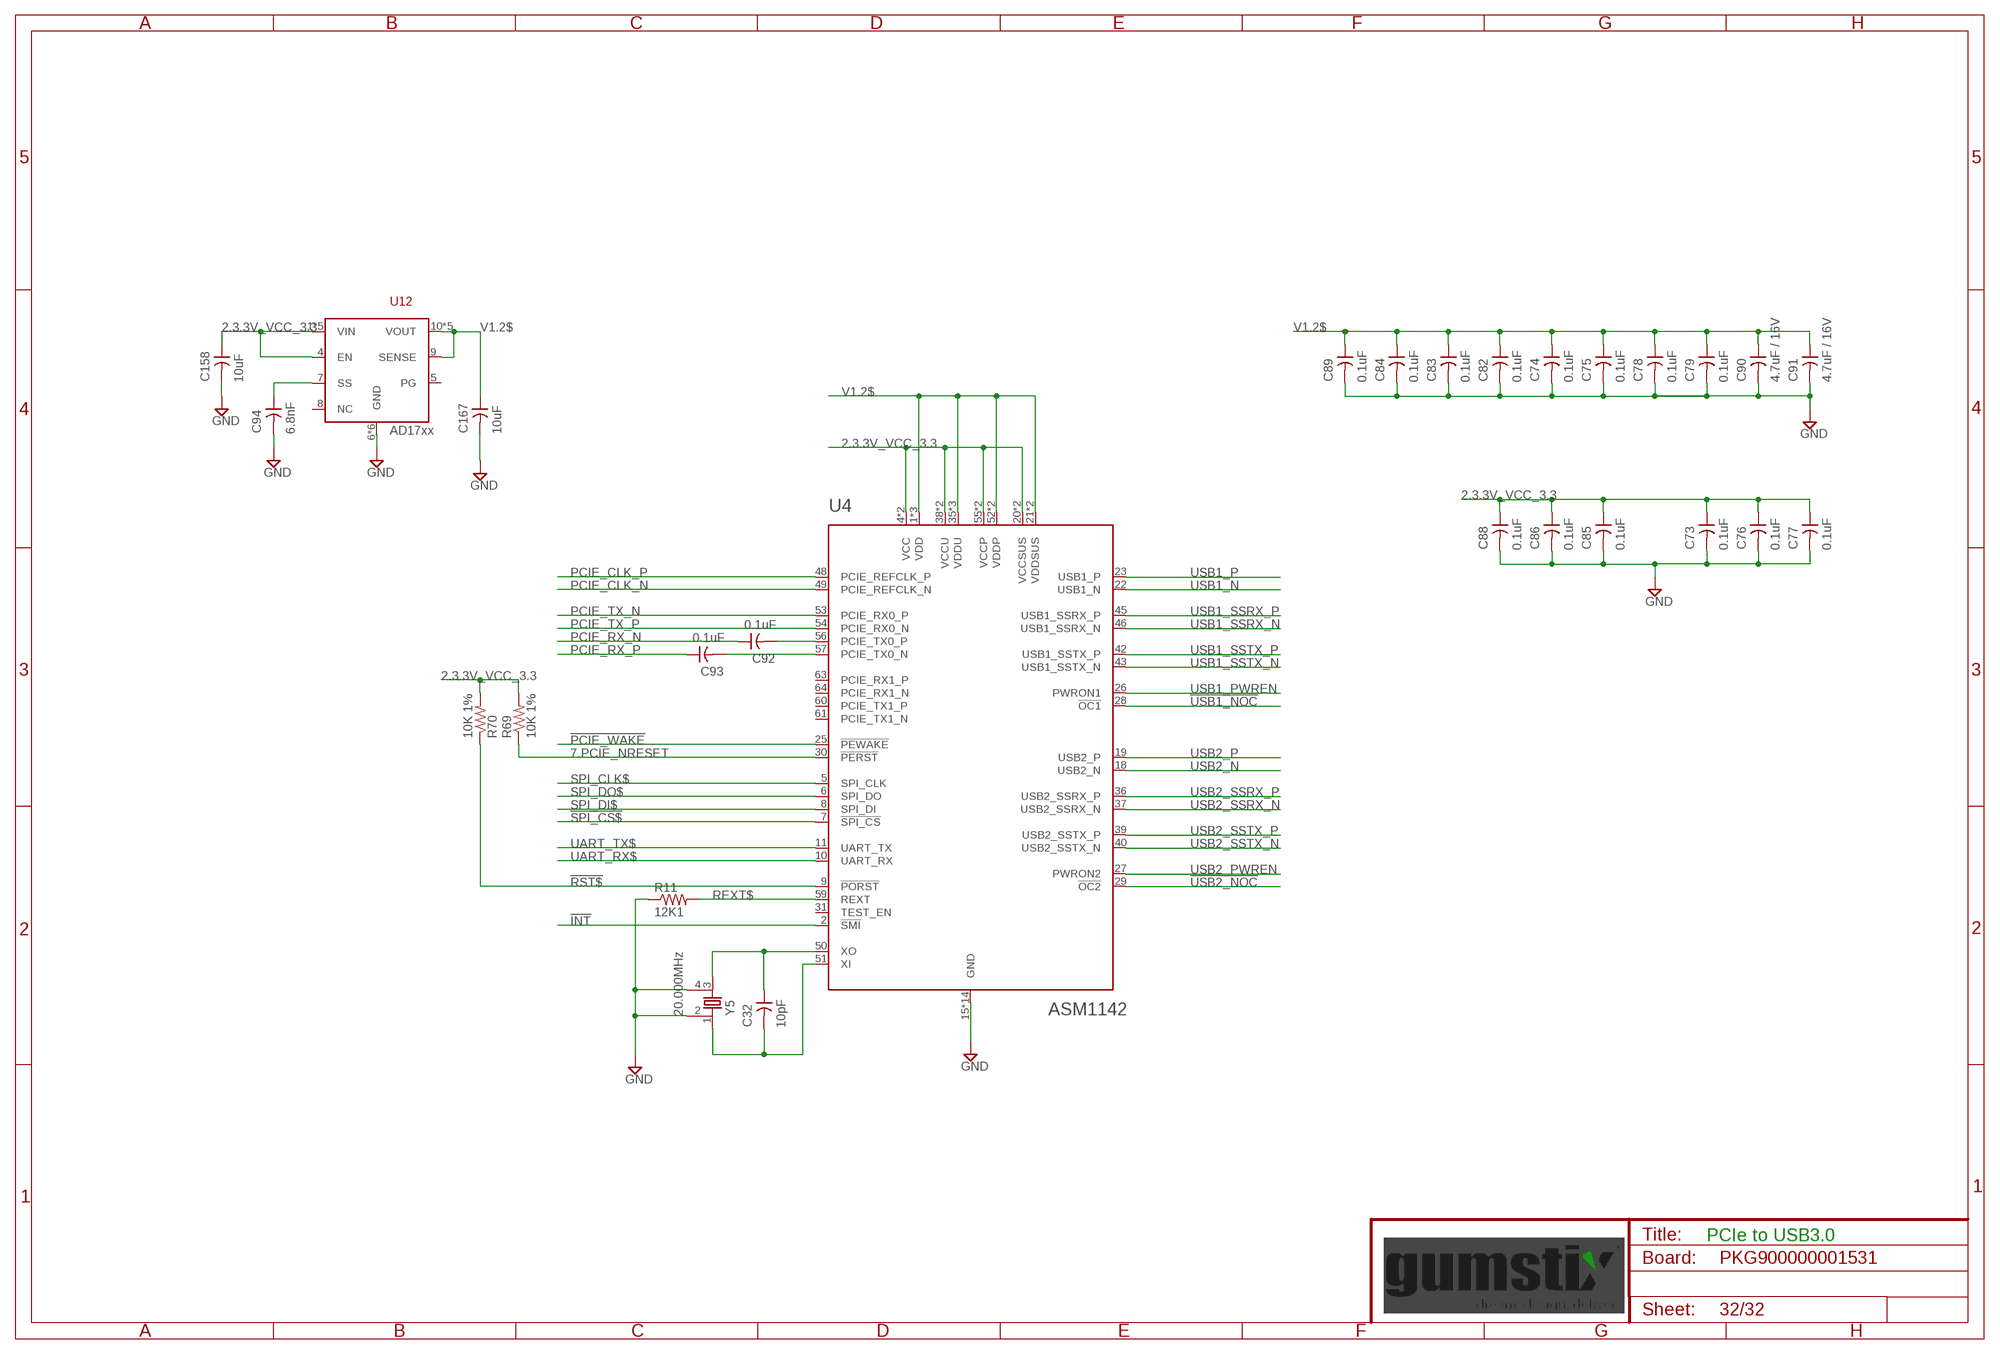
[diagram p31: schematic, sheet 32]

### Parts
C32  10pF  C0201  [0201]
C73  0.1uF  C0201  [0201]
C74  0.1uF  C0201  [0201]
C75  0.1uF  C0201  [0201]
C76  0.1uF  C0201  [0201]
C77  0.1uF  C0201  [0201]
C78  0.1uF  C0201  [0201]
C79  0.1uF  C0201  [0201]
C82  0.1uF  C0201  [0201]
C83  0.1uF  C0201  [0201]
C84  0.1uF  C0201  [0201]
C85  0.1uF  C0201  [0201]
C86  0.1uF  C0201  [0201]
C88  0.1uF  C0201  [0201]
C89  0.1uF  C0201  [0201]
C90  4.7uF / 16V  C0603  [0603]
C91  4.7uF / 16V  C0603  [0603]
C92  0.1uF  C0201  [0201]
C93  0.1uF  C0201  [0201]
C94  6.8nF  C0201  [0201]
C158  10uF  C0603  [0603]
C167  10uF  C0603  [0603]
R11  12K1  R0201  [0201]
R69  10K 1%  R0201  [0201]
R70  10K 1%  R0201  [0201]
U4  ASM1142  [QFN64-9X9MM-FT2232HQ]
U12  ADP1740ACPZ-1.2-R7  ADP174X  [LFCSPWQ16]
Y5  20.000MHz  Y4CRYSTAL-3225  [CRYSTAL-3225]

### Nets
2.3.3V_VCC_3.3 [supply]: C73.1 C76.1 C77.1 C85.1 C86.1 C88.1 C158.1 R69.2 R70.2 U4.4(VCC) U4.20(VCCSUS) U4.24(VCCSUS) U4.32(VCC) U4.38(VCCU) U4.44(VCCU) U4.55(VCCP) U4.62(VCCP) U12.1(VIN) U12.2(VIN) U12.3(VIN) U12.4(EN) U12.15(VIN) U12.16(VIN) ; also sheet 2,3,4,5,11,12,14,15,19,20,21,22,29,30
7.PCIE_NRESET: R69.1 U4.30(!PERST) ; also sheet 17
!INT: U4.2(!SMI)
!PCIE_WAKE: U4.25(!PEWAKE)
!RST$: R70.1 U4.9(!PORST)
!SPI_CS$: U4.7(!SPI_CS)
!USB1_NOC: U4.28(!OC1)
!USB2_NOC: U4.29(!OC2)
GND [supply]: C73.2 C74.2 C75.2 C76.2 C77.2 C78.2 C79.2 C82.2 C83.2 C84.2 C85.2 C86.2 C88.2 C89.2 C90.2 C91.2 C94.2 C158.2 C167.2 R11.1 U4.15(GND) U4.65(GND) U4.EPAD1(GND) U4.EPAD2(GND) U4.EPAD3(GND) U4.EPAD4(GND) U4.EPAD5(GND) U4.EPAD6(GND) U4.EPAD7(GND) U4.EPAD8(GND) U4.EPAD9(GND) U4.EPAD10(GND) U4.EPAD11(GND) U4.EPAD12(GND) U12.6(GND) U12.EP1(GND) U12.EP2(GND) U12.EP3(GND) U12.EP4(GND) U12.EP(GND) Y5.2 Y5.4 ; also sheet 2,3,4,5,6,7,8,9,10,12,13,14,15,16,17,18,19,20,21,22,23,24,25,26,27,28,29,30,31
PCIE_CLK_N [USB]: U4.49(PCIE_REFCLK_N) ; also sheet 17
PCIE_CLK_P [USB]: U4.48(PCIE_REFCLK_P) ; also sheet 17
PCIE_RX0__N [USB]: C93.2 U4.57(PCIE_TX0_N)
PCIE_RX0__P [USB]: C92.2 U4.56(PCIE_TX0_P)
PCIE_RX_N [USB]: C92.1 ; also sheet 17
PCIE_RX_P [USB]: C93.1 ; also sheet 17
PCIE_TX_N [USB]: U4.53(PCIE_RX0_P) ; also sheet 17
PCIE_TX_P [USB]: U4.54(PCIE_RX0_N) ; also sheet 17
REXT$: R11.2 U4.59(REXT)
SPI_CLK$: U4.5(SPI_CLK)
SPI_DI$: U4.8(SPI_DI)
SPI_DO$: U4.6(SPI_DO)
UART_RX$: U4.10(UART_RX)
UART_TX$: U4.11(UART_TX)
USB1_N [USB]: U4.22(USB1_N) ; also sheet 28
USB1_P [USB]: U4.23(USB1_P) ; also sheet 28
USB1_PWREN: U4.26(PWRON1)
USB1_SSRX_N [USB]: U4.46(USB1_SSRX_N) ; also sheet 28
USB1_SSRX_P [USB]: U4.45(USB1_SSRX_P) ; also sheet 28
USB1_SSTX_N [USB]: U4.43(USB1_SSTX_N) ; also sheet 28
USB1_SSTX_P [USB]: U4.42(USB1_SSTX_P) ; also sheet 28
USB2_N [USB]: U4.18(USB2_N)
USB2_P [USB]: U4.19(USB2_P)
USB2_PWREN: U4.27(PWRON2)
USB2_SSRX_N [USB]: U4.37(USB2_SSRX_N)
USB2_SSRX_P [USB]: U4.36(USB2_SSRX_P)
USB2_SSTX_N [USB]: U4.40(USB2_SSTX_N)
USB2_SSTX_P [USB]: U4.39(USB2_SSTX_P)
V1.2$ [supply]: C74.1 C75.1 C78.1 C79.1 C82.1 C83.1 C84.1 C89.1 C90.1 C91.1 C167.1 U4.1(VDD) U4.12(VDD) U4.21(VDDSUS) U4.33(VDD) U4.34(VDDSUS) U4.35(VDDU) U4.41(VDDU) U4.47(VDDU) U4.52(VDDP) U4.58(VDDP) U12.9(SENSE) U12.10(VOUT) U12.11(VOUT) U12.12(VOUT) U12.13(VOUT) U12.14(VOUT)
VCC1V1_SS$: C94.1 U12.7(SS)
XI$: C32.2 U4.51(XI) Y5.1
XO$: C32.1 U4.50(XO) Y5.3
Unconnected: U4.31(TEST_EN) U4.60(PCIE_TX1_P) U4.61(PCIE_TX1_N) U4.63(PCIE_RX1_P) U4.64(PCIE_RX1_N) U12.5(PG) U12.8(NC)

### Notes on the sheet
- PCIe to USB3.0

## Library data of the parts
C1-C3 C6 C14 C16 C27 C32 C34 C38-C41 C47-C49 C51-C56 C60-C65 C70-C79 C82-C86 C88 C89 C92-C94 C232 C262 C270 C271 = qualified_1:C; HEIGHT: 0.25
C4 C243 = qualified_1:C; DM: 0; DR: 0.000; DX: 58.600; DY: 19.050; HEIGHT: 0.25; SHEETNO: 4
C5 C244 C247 C249 = qualified_1:C; DM: 0; DR: 90.000; DX: 64.700; DY: 10.600; HEIGHT: 0.25; SHEETNO: 4
C7 C13 C18-C20 C25 C26 C29 C30 C37 C42-C45 C57 C58 C68 C95 C97 C227 C229 C234-C241 C248 C256 C257 C259-C261 = qualified_1:C; DM: 0; DR: 90.000; DX: 5.600; DY: 28.400; HEIGHT: 0.25; SHEETNO: 2
C8 C31 C46 C59 C96 C226 C231 = qualified_1:C; HEIGHT: 0.35
C9 C246 C250 = qualified_1:C; DM: 0; DR: 0.000; DX: 66.900; DY: 11.100; HEIGHT: 0.5; SHEETNO: 4
C10 C21 C24 C35 C36 = qualified_1:C; DM: 0; DR: -270.000; DX: -17.200; DY: 6.600; HEIGHT: 0.25; SHEETNO: 9
C11 = qualified_1:C; DM: 0; DR: -90.000; DX: -20.800; DY: 6.600; HEIGHT: 0.25; SHEETNO: 9
C12 C17 C69 = qualified_1:C; DM: 0; DR: 90.000; DX: 5.600; DY: 28.400; HEIGHT: 0.35; SHEETNO: 2
C15 C28 C90 C91 C158 C167 = qualified_1:C; HEIGHT: 0.5
C22 C23 C33 C50 C258 C263 = qualified_1:C; DM: 0; DR: 180.000; DX: 70.250; DY: 17.350; HEIGHT: 0.5; SHEETNO: 5
C66 C67 = qualified_1:C; HEIGHT: 0.51
C228 = qualified_1:C; DM: 0; DR: -90.000; DX: 1.400; DY: -9.000; HEIGHT: 0.35; SHEETNO: 9
C230 = qualified_1:C; DM: 0; DR: 0.000; DX: 74.600; DY: 25.600; HEIGHT: 0.51; SHEETNO: 1
C233 = qualified_1:C; DM: 0; DR: 270.000; DX: 71.300; DY: 21.800; HEIGHT: 0.51; SHEETNO: 1
C245 C253 = qualified_1:C; DM: 0; DR: 0.000; DX: 66.300; DY: 12.650; HEIGHT: 0.25; SHEETNO: 4
D1 = qualified_1:ESD-DIODE; HEIGHT: 0.35
D2 = qualified_1:EAST1616RGBB4
D5 = qualified_1:SCHOTTKY-DIODE: Schottky Diode
FB1 FB4 = qualified_1:FB; DM: 0; DR: 0.000; DX: 56.400; DY: 28.200; HEIGHT: 0.35; SHEETNO: 2
FB2 = qualified_1:FB; HEIGHT: 0.35
FB3 = qualified_1:FB; DM: 0; DR: 90.000; DX: 11.200; DY: 28.400; HEIGHT: 0.35; SHEETNO: 2
FD1-FD8 = qualified_1:FIDUCIAL; HEIGHT: 0
IC1 = qualified_1:AT24C*: 2-wire serial EEPROM; HEIGHT: 1
IC2 IC5 = qualified_1:FT232R: Source: http://www.ftdichip.com/Documents/DataSheets/DS_FT232R_v104.pdf; DM: 0; DR: 0.000; DX: 61.700; DY: 13.850; HEIGHT: 0.9; MPN: FT232RQ; OC_FARNELL: 1146033; OC_NEWARK: 91K9919; SHEETNO: 4
IC3 = qualified_1:TPS62111; DM: 0; DR: 180.000; DX: 74.800; DY: 22.000; HEIGHT: 1; SHEETNO: 1
IC6 IC7 = qualified_1:SN74LVC1G126: Single Bus Buffer Gate With 3-State Outputs; DM: 0; DR: 90.000; DX: 58.050; DY: 17.100; HEIGHT: 1.1; SHEETNO: 4
J1 = qualified_1:JST-GH-5
J2 J8 = qualified_1:DF40C-100DS-0.4V(51): DF40 Series 100 Position Dual Row 0.4 mm Pitch Surface Mount Vertical Receptacle; DESCRIPTION: DF40 Series 100 Position Dual Row 0.4 mm Pitch Surface Mount Vertical Receptacle; DIGI-KEY_PART_NUMBER: H11615CT-ND; DIGI-KEY_PURCHASE_URL: https://www.digikey.ca/product-detail/en/hirose-electric-co-ltd/DF40C-100DS-0.4V_51_/H11615CT-ND/1969495?utm_source=snapeda&utm_medium=aggregator&utm_campaign=symbol; MF: Hirose; MP: DF40C-100DS-0.4V_51_; PACKAGE: None
J3 = qualified_1:USD_WURTH
J5 = qualified_1:SM10B-SRSS-TB: 10 Positions Header Connector 0.039" (1.00mm) Surface Mount, Right Angle Tin
J7 = qualified_1:USB-TYPE-C
J9 = qualified_1:CON8X3; HEIGHT: 0
J10 J11 = qualified_1:FPC-15: FPC 15 Connector 15 pin 1mm pitch FPC connector
J12 J13 = qualified_1:JST-GH-6
J14 = qualified_1:JST-GH-4
L1 = qualified_1:L; HEIGHT: 1.9
L9 = qualified_1:COM_MODE_CHOKE; HEIGHT: 0.83
MP1-MP4 = qualified_1:BULLET_CONN: Bullet connector (for RC) solder pad.
Q1 Q3 Q4 Q6 = qualified_1:MOSFET_P_ENH; HEIGHT: 1.12
Q5 = qualified_1:BSS138: N-Channel Enhancement MOSFET; HEIGHT: 1.12
R1-R4 R6-R11 R13 R17 R19-R21 R27 R28 R31 R38-R43 R46-R59 R68-R70 R77-R80 R82 R85-R90 R101 R103-R115 R117 R119 R120 = qualified_1:R; HEIGHT: 0.25
R5 R12 R18 R22-R25 R75 R76 R91-R93 R95-R100 R102 R123 R124 = qualified_1:R; DM: 0; DR: -270.000; DX: -20.800; DY: 8.200; HEIGHT: 0.25; SHEETNO: 9
R14 R26 R29 R30 R32-R37 R71 = qualified_1:R; HEIGHT: 0.35
R15 R16 R44 R45 = qualified_1:R; DM: 0; DR: 270.000; DX: 72.800; DY: 18.400; HEIGHT: 0.25; SHEETNO: 1
R81 R83 = qualified_1:R; DM: 0; DR: 270.000; DX: 72.800; DY: 18.400; HEIGHT: 0.35; SHEETNO: 1
RP2 RP3 = qualified_1:RP741X163; HEIGHT: 0.5
RT4 RT5 = qualified_1:R; HEIGHT: 0.51
S1 = qualified_1:EVQ; HEIGHT: 2
S2 S3 = qualified_1:EVQ
U1 U25 = qualified_1:TPS2041; HEIGHT: 1.1
U2 = qualified_1:TJA1051TK/3: TJA1051 Single 5 V 1 MBd Surface Mount High Speed CAN Transceiver - HVSON-8; ARROW_ELECTRONICS-PURCHASE-URL: https://snapeda.com/shop?store=Arrow+Electronics&id=608431; DESCRIPTION: 1/1 Transceiver Half CANbus 8-HVSON (3x3); DIGI-KEY_PART_NUMBER: 568-15202-1-ND; MF: NXP USA; MOUSER-PURCHASE-URL: https://snapeda.com/shop?store=Mouser&id=608431; MP: TJA1051TK/3/1J; PACKAGE: VDFN-8 NXP Semiconductors
U3 U8 U17 U18 U107 = qualified_1:TPD4E02B04: TPD4E02B04 4-Channel ESD Protection Diode for USB Type-C and HDMI 2.0 http://www.ti.com/lit/ds/symlink/tpd4e02b04.pdf
U4 = qualified_1:ASM1142: ASM1142 PCI Express to 2 ports SuperSpeed USB 10Gbps xHCI Host Controller
U5 = qualified_1:G313-06329-00
U6 = qualified_1:NCP308: The NCP308 series is one of the ON Semiconductor Supervisory circuit IC families. It is optimized to monitor system voltages from 0.405 V to 5.5 V, asserting an active low open−drain RESET output, together with Manual Reset (MR) Input.
U7 = qualified_1:ICM-42688-P
U9 = qualified_1:BMM150: The BMM150 is a standalone geomagnetic sensor for consumer market applications. It allows measurements of the magnetic field in three perpendicular axes.
U10 = qualified_1:MS5611-01
U11 = qualified_1:ICM-20602: World's Best 6-Axis Integrated s
U12 = qualified_1:ADP174X: ADP1740 <http://www.analog.com/media/en/technical-documentation/data-sheets/ADP1740_1741.pdf> series of fixed voltage LDO. Max 2A output at 0.75, 1, 1.1, 1.2, 1.3, 1.5, 1.8, 2.5V
U13 = qualified_1:USB3300-EZK-TR: None; AVAILABILITY: Unavailable; DESCRIPTION: USB Controller USB 2.0, OTG ULPI Interface 32-QFN (5x5); MF: Microchip; MP: USB3300-EZK-TR; PACKAGE: QFN-32 Microchip; PRICE: None
U14 = qualified_1:USB2517-JZX: IC, 7-PORT USB 2.0 HUB CONTRL, 64QFN
U15 = qualified_1:BMI088: 6-Axis inertial sensor with Gyro and Accelerometer
U16 U101 U109 = qualified_1:MIC94080: MIC94080 Load Switch http://ww1.microchip.com/downloads/en/DeviceDoc/MIC9408x-67mOhm-RDSON-2A-High-Side-Load-Switch-DS20006118A.pdf
U19 = qualified_1:TXS0104E: 4-bit Bidirectional Level Translator http://www.ti.com/lit/ds/symlink/txs0104e.pdf
U30 = qualified_1:TS3A5223: TS3A5223 0.45Ω Dual SPDT Bidirectional Analog Switch Package: UQFN-10 Source: http://www.ti.com/lit/ds/symlink/ts3a5223.pdf
U100 = qualified_1:STM32H753II
U105 = qualified_1:TPS2121: TPS2121 Priority Power Mux http://www.ti.com/lit/ds/symlink/tps2121.pdf
U106 = qualified_1:FM25V02A-DG
U108 = qualified_1:BMP388: Digital pressure sensor.
U$2 = qualified_1:UPVERTER_LABEL; BOARD: PCB900000001531v4; TITLE: RPi CM4 + Pixhawk FMUv6U; YEAR: 2021
Y1 Y2 Y4 Y5 = qualified_1:Y4; HEIGHT: 0.8
Y3 = qualified_1:X2; HEIGHT: 0.51

## Net classes
1 supply: width 0.254 mm
2 analog: width 0.178 mm
4 xxwide: width 0.203 mm
5 USB: width 0.2 mm, clearance 0.2 mm
6 HDMI: width 0.2 mm, clearance 0.3 mm
7 50_OHM: width 0.378 mm, clearance 0.3 mm